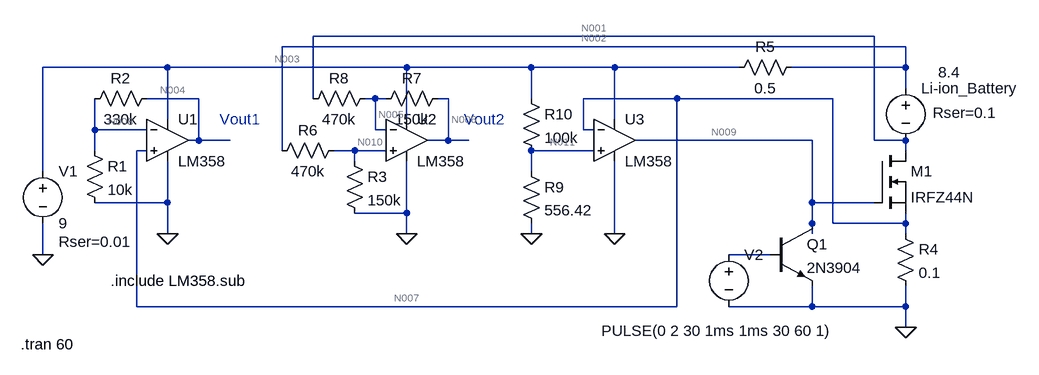
[diagram p0: schematic Li-ion_Charger_Circuit_Simulation.asc]
Li-ion_Charger_Circuit_Simulation.asc, the LTspice schematic file:
Version 4
SHEET 1 1416 680
WIRE 944 -192 80 -192
WIRE 992 -176 32 -176
WIRE -144 -144 -336 -144
WIRE 224 -144 -144 -144
WIRE 416 -144 224 -144
WIRE 544 -144 416 -144
WIRE 736 -144 544 -144
WIRE 992 -144 992 -176
WIRE 992 -144 816 -144
WIRE 992 -112 992 -144
WIRE -96 -96 -176 -96
WIRE 80 -96 80 -192
WIRE 176 -96 160 -96
WIRE 192 -96 176 -96
WIRE 288 -96 272 -96
WIRE 416 -96 416 -144
WIRE 640 -96 496 -96
WIRE 880 -96 640 -96
WIRE -144 -64 -144 -144
WIRE 224 -64 224 -144
WIRE 544 -64 544 -144
WIRE -256 -48 -256 -96
WIRE -176 -48 -256 -48
WIRE 176 -48 176 -96
WIRE 192 -48 176 -48
WIRE 496 -48 496 -96
WIRE 512 -48 496 -48
WIRE -96 -32 -96 -96
WIRE -96 -32 -112 -32
WIRE -48 -32 -96 -32
WIRE 288 -32 288 -96
WIRE 288 -32 256 -32
WIRE 320 -32 288 -32
WIRE 848 -32 576 -32
WIRE 944 -32 944 -192
WIRE 992 -32 944 -32
WIRE -256 -16 -256 -48
WIRE -176 -16 -192 -16
WIRE 32 -16 32 -176
WIRE 144 -16 112 -16
WIRE 192 -16 144 -16
WIRE 512 -16 416 -16
WIRE 992 -16 992 -32
WIRE 144 0 144 -16
WIRE -336 16 -336 -144
WIRE 416 16 416 -16
WIRE -144 64 -144 0
WIRE -144 64 -256 64
WIRE 848 64 848 -32
WIRE 944 64 848 64
WIRE 224 80 224 0
WIRE 224 80 144 80
WIRE 848 96 848 64
WIRE 880 96 880 -96
WIRE 992 96 992 80
WIRE 992 96 880 96
WIRE -144 112 -144 64
WIRE 224 112 224 80
WIRE 416 112 416 96
WIRE 544 112 544 0
WIRE 848 112 848 96
WIRE 992 112 992 96
WIRE -336 144 -336 96
WIRE 784 144 720 144
WIRE -192 224 -192 -16
WIRE 640 224 640 -96
WIRE 640 224 -192 224
WIRE 848 224 848 192
WIRE 848 224 720 224
WIRE 992 224 992 192
WIRE 992 224 848 224
WIRE 992 256 992 224
FLAG -336 144 0
FLAG -144 112 0
FLAG 224 112 0
FLAG 544 112 0
FLAG 992 256 0
FLAG 416 112 0
SYMBOL res -272 -32 R0
SYMATTR InstName R1
SYMATTR Value 10k
SYMBOL res -160 -112 R90
WINDOW 0 0 56 VBottom 2
WINDOW 3 32 56 VTop 2
SYMATTR InstName R2
SYMATTR Value 330k
SYMBOL Opamps\\opamp2 -144 -96 R0
SYMATTR InstName U1
SYMATTR Value LM358
SYMATTR SpiceModel LM358
SYMBOL Opamps\\opamp2 224 -96 R0
SYMATTR InstName U2
SYMATTR Value LM358
SYMATTR SpiceModel LM358
SYMBOL voltage -336 0 R0
WINDOW 123 0 0 Left 0
WINDOW 39 24 124 Left 2
SYMATTR InstName V1
SYMATTR Value 9
SYMATTR SpiceLine Rser=0.01
SYMBOL Opamps\\opamp2 544 -96 R0
SYMATTR InstName U3
SYMATTR Value LM358
SYMATTR SpiceModel LM358
SYMBOL res 128 -16 R0
SYMATTR InstName R3
SYMATTR Value 150k
SYMBOL nmos 944 -16 R0
SYMATTR InstName M1
SYMATTR Value IRFZ44N
SYMBOL npn 784 96 R0
SYMATTR InstName Q1
SYMATTR Value 2N3904
SYMBOL res 976 96 R0
SYMATTR InstName R4
SYMATTR Value 0.1
SYMBOL voltage 720 128 R0
WINDOW 3 -196 133 Left 2
WINDOW 123 0 0 Left 0
WINDOW 39 0 0 Left 0
SYMATTR InstName V2
SYMATTR Value PULSE(0 2 30 1ms 1ms 30 60 1)
SYMBOL voltage 992 -128 R0
WINDOW 3 50 -9 Left 2
WINDOW 123 0 0 Left 0
WINDOW 39 42 54 Left 2
SYMATTR InstName Li-ion_Battery
SYMATTR Value 8.4
SYMATTR SpiceLine Rser=0.1
SYMBOL res 128 -32 R90
WINDOW 0 0 56 VBottom 2
WINDOW 3 32 56 VTop 2
SYMATTR InstName R6
SYMATTR Value 470k
SYMBOL res 288 -112 R90
WINDOW 0 0 56 VBottom 2
WINDOW 3 32 56 VTop 2
SYMATTR InstName R7
SYMATTR Value 150k
SYMBOL res 176 -112 R90
WINDOW 0 0 56 VBottom 2
WINDOW 3 32 56 VTop 2
SYMATTR InstName R8
SYMATTR Value 470k
SYMBOL res 400 0 R0
SYMATTR InstName R9
SYMATTR Value 556.42
SYMBOL res 400 -112 R0
SYMATTR InstName R10
SYMATTR Value 100k
SYMBOL res 832 -160 R90
WINDOW 0 0 56 VBottom 2
WINDOW 3 32 56 VTop 2
SYMATTR InstName R5
SYMATTR Value 0.5
TEXT -232 184 Left 2 !.include LM358.sub
TEXT -64 -64 Left 2 ;Vout1
TEXT 312 -64 Left 2 ;Vout2
TEXT -370 282 Left 2 !.tran 60

The netlist it stands for:
* Li-ion_Charger_Circuit_Simulation.asc
R1 N008 0 10k
R2 N004 N008 330k
XU1 N007 N008 N003 0 N004 LM358 LM358  ; pins In+ In- V+ V- OUT
XU2 N010 N005 N003 0 N006 LM358 LM358  ; pins In+ In- V+ V- OUT
V1 N003 0 9 Rser=0.01
XU3 N011 N007 N003 0 N009 LM358 LM358  ; pins In+ In- V+ V- OUT
R3 N010 0 150k
M1 N001 N009 N007 N007 IRFZ44N
Q1 N009 N012 0 0 2N3904
R4 N007 0 0.1
V2 N012 0 PULSE(0 2 30 1ms 1ms 30 60 1)
V§Li-ion_Battery N002 N001 8.4 Rser=0.1
R6 N010 N002 470k
R7 N006 N005 150k
R8 N005 N001 470k
R9 N011 0 556.42
R10 N003 N011 100k
R5 N002 N003 0.5
.model NPN NPN
.model PNP PNP
.lib standard.bjt
.model NMOS NMOS
.model PMOS PMOS
.lib standard.mos
.include LM358.sub
* Vout1
* Vout2
.tran 60
.backanno
.end

* Results of the author's LTspice run, read from the files saved beside the schematic
* Operating Point, zero values left out:
*   V(n008) = 50.24 mV
*   V(n004) = 1.702 V
*   V(n003) = 8.995 V
*   V(n007) = 50 mV
*   V(n006) = 2.697 V
*   V(n005) = 2.118 V
*   V(n010) = 2.118 V
*   V(n009) = 4.269 V
*   V(n011) = 49.78 mV
*   V(n001) = 295 mV
*   V(n002) = 8.745 V
*   Ic(Q1) = 4.281 pA
*   Ib(Q1) = -4.271 pA
*   Id(M1) = 500 mA
*   Is(M1) = -500 mA
*   I(R5) = -500 mA
*   I(R10) = 89.45 µA
*   I(R9) = 89.47 µA
*   I(R8) = 3.879 µA
*   I(R7) = 3.859 µA
*   I(R6) = -14.1 µA
*   I(R4) = 500 mA
*   I(R3) = 14.12 µA
*   I(R2) = 5.004 µA
*   I(R1) = 5.024 µA
*   I(Li-ion_battery) = 500 mA
*   I(V2) = 4.271 pA
*   I(V1) = -501 mA
*   Ix(u1:1) = -20.45 nA
*   Ix(u1:2) = -20.32 nA
*   Ix(u1:3) = 306.8 µA
*   Ix(u1:4) = -307 µA
*   Ix(u1:5) = -5.004 µA
*   Ix(u2:1) = -20.21 nA
*   Ix(u2:2) = -20.15 nA
*   Ix(u2:3) = 306.8 µA
*   Ix(u2:4) = -306.9 µA
*   Ix(u2:5) = -3.859 µA
*   Ix(u3:1) = -20.44 nA
*   Ix(u3:2) = -20.33 nA
*   Ix(u3:3) = 306.8 µA
*   Ix(u3:4) = -307 µA
*   Ix(u3:5) = -4.28 pA
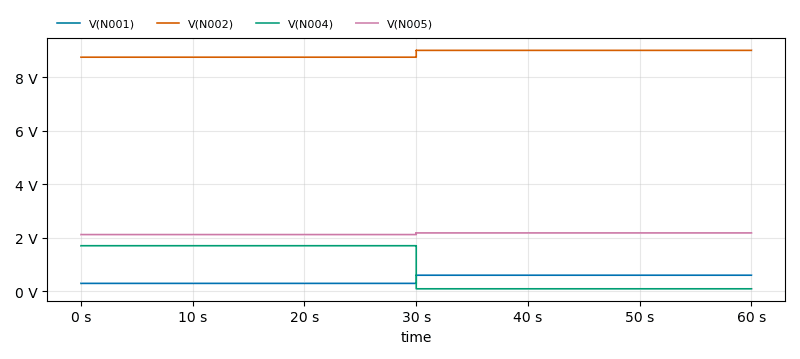
[diagram p1: Transient Analysis of Li-ion_Charger_Circuit_Simulation.asc, plotted from the saved traces]
* Transient Analysis, 1 run:
*   V(N001): min 295 mV, max 600 mV, average 447.5 mV, rms 472.8 mV, last 600 mV
*   V(N002): min 8.745 V, max 9 V, average 8.872 V, rms 8.873 V, last 9 V
*   V(N004): min 92.3 mV, max 1.702 V, average 896.9 mV, rms 1.205 V, last 92.3 mV
*   V(N005): min 2.118 V, max 2.18 V, average 2.149 V, rms 2.149 V, last 2.18 V